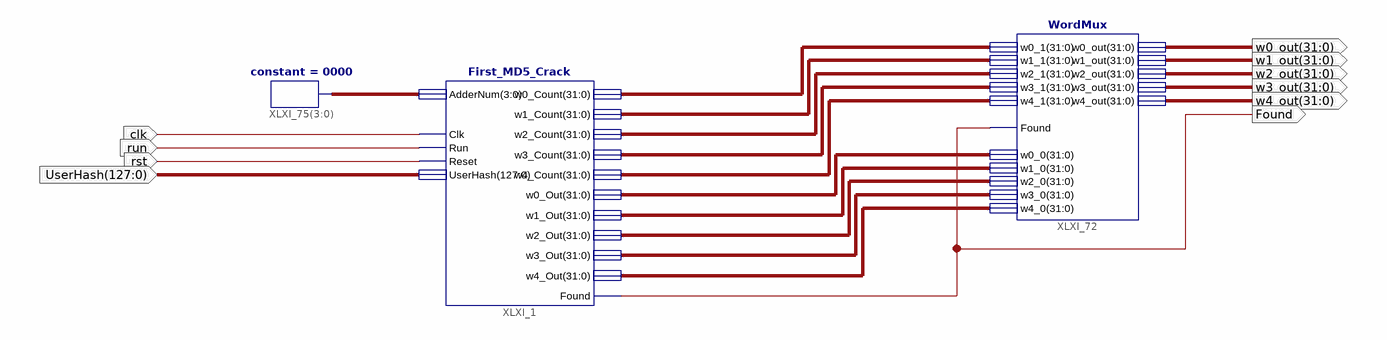
[diagram p0: schematic sheet 1]
// Xilinx ISE schematic MD5_Toplevel.sch (spartan3a) as structural Verilog: 3 symbols, 10 ports
module MD5_Toplevel (
  input  clk,
  input  run,
  input  rst,
  input  [127:0] UserHash,
  output Found,
  output [31:0] w0_out,
  output [31:0] w1_out,
  output [31:0] w2_out,
  output [31:0] w3_out,
  output [31:0] w4_out
);

  wire [3:0] XLXN_79;
  wire [31:0] XLXN_19, XLXN_20, XLXN_21, XLXN_24, XLXN_27, XLXN_146, XLXN_147, XLXN_148, XLXN_149, XLXN_150;

  First_MD5_Crack XLXI_1 (
    .AdderNum(XLXN_79), .Reset(rst), .Clk(clk), .Run(run), .UserHash(UserHash), .Found(Found),
    .w0_Out(XLXN_19), .w1_Out(XLXN_20), .w2_Out(XLXN_27), .w3_Out(XLXN_24), .w4_Out(XLXN_21),
    .w0_Count(XLXN_150), .w1_Count(XLXN_149), .w2_Count(XLXN_147), .w3_Count(XLXN_148), .w4_Count(XLXN_146));
  constant #(.CValue("0000")) XLXI_75[3:0] (.O(XLXN_79));
  WordMux XLXI_72 (
    .w4_0(XLXN_21), .w3_0(XLXN_24), .w2_0(XLXN_27), .w1_0(XLXN_20), .w0_0(XLXN_19), .Found(Found),
    .w4_1(XLXN_146), .w3_1(XLXN_148), .w2_1(XLXN_147), .w1_1(XLXN_149), .w0_1(XLXN_150), .w1_out(w1_out),
    .w0_out(w0_out), .w2_out(w2_out), .w3_out(w3_out), .w4_out(w4_out));

  // Notes on the sheet:
  //   KEEP on signal clk = 
endmodule
